# Altium project LedFlex.PrjPcb (part 3 of 4)
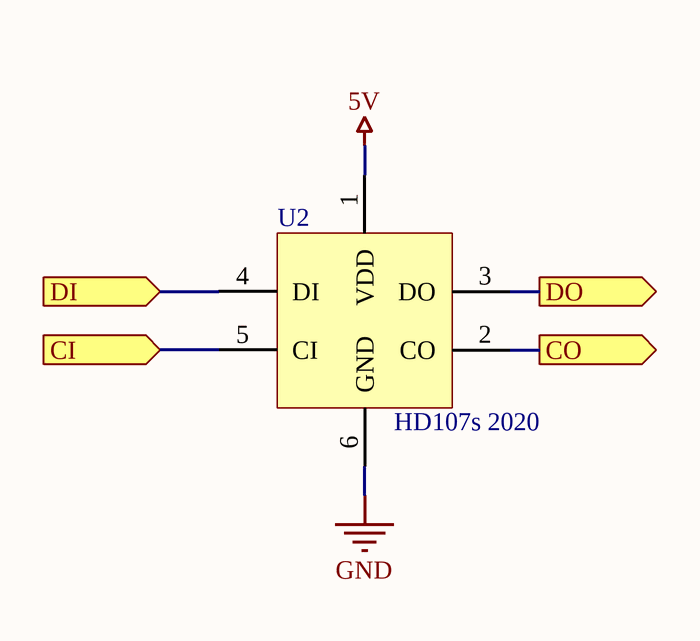
[diagram p3: LED_B.SchDoc]
## Nets that join several sheets
5V: LEDA1 (U1_1.1), LEDA2 (U1_2.1), LEDA3 (U1_3.1), LEDA4 (U1_4.1), LEDA5 (U1_5.1), LEDA6 (U1_6.1), LEDA7 (U1_7.1), LEDA8 (U1_8.1), LEDA9 (U1_9.1), LEDA10 (U1_10.1), LEDA11 (U1_11.1), LEDA12 (U1_12.1), LEDA13 (U1_13.1), LEDA14 (U1_14.1), LEDA15 (U1_15.1), LEDA16 (U1_16.1), LEDA17 (U1_17.1), LEDA18 (U1_18.1), LEDA19 (U1_19.1), LEDA20 (U1_20.1), LEDA21 (U1_21.1), LEDA22 (U1_22.1), LEDA23 (U1_23.1), LEDA24 (U1_24.1), LEDA25 (U1_25.1), LEDA26 (U1_26.1), LEDA27 (U1_27.1), LEDA28 (U1_28.1), LEDA29 (U1_29.1), LEDA30 (U1_30.1), LEDA31 (U1_31.1), LEDA32 (U1_32.1), LEDA33 (U1_33.1), LEDA34 (U1_34.1), LEDA35 (U1_35.1), LEDA36 (U1_36.1), LEDA37 (U1_37.1), LEDA38 (U1_38.1), LEDA39 (U1_39.1), LEDA40 (U1_40.1), LEDA41 (U1_41.1), LEDA42 (U1_42.1), LEDA43 (U1_43.1), LEDA44 (U1_44.1), LEDA45 (U1_45.1), LEDA46 (U1_46.1), LEDA47 (U1_47.1), LEDA48 (U1_48.1), LEDA49 (U1_49.1), LEDA50 (U1_50.1), LEDA51 (U1_51.1), LEDA52 (U1_52.1), LEDA53 (U1_53.1), LEDA54 (U1_54.1), LEDA55 (U1_55.1), LEDA56 (U1_56.1), LEDA57 (U1_57.1), LEDA58 (U1_58.1), LEDA59 (U1_59.1), LEDA60 (U1_60.1), LEDA61 (U1_61.1), LEDA62 (U1_62.1), LEDA63 (U1_63.1), LEDA64 (U1_64.1), LEDA65 (U1_65.1), LEDA66 (U1_66.1), LEDA67 (U1_67.1), LEDA68 (U1_68.1), LEDA69 (U1_69.1), LEDA70 (U1_70.1), LEDA71 (U1_71.1), LEDA72 (U1_72.1), LEDA73 (U1_73.1), LEDA74 (U1_74.1), LEDA75 (U1_75.1), LEDA76 (U1_76.1), LEDA77 (U1_77.1), LEDA78 (U1_78.1), LEDA79 (U1_79.1), LEDA80 (U1_80.1), LEDA81 (U1_81.1), LEDA82 (U1_82.1), LEDA83 (U1_83.1), LEDA84 (U1_84.1), LEDA85 (U1_85.1), LEDA86 (U1_86.1), LEDA87 (U1_87.1), LEDA88 (U1_88.1), LEDA89 (U1_89.1), LEDA90 (U1_90.1), LEDA91 (U1_91.1), LEDA92 (U1_92.1), LEDA93 (U1_93.1), LEDA94 (U1_94.1), LEDA95 (U1_95.1), LEDA96 (U1_96.1), LEDA97 (U1_97.1), LEDA98 (U1_98.1), LEDA99 (U1_99.1), LEDA100 (U1_100.1), LEDA101 (U1_101.1), LEDA102 (U1_102.1), LEDA103 (U1_103.1), LEDA104 (U1_104.1), LEDA105 (U1_105.1), LEDA106 (U1_106.1), LEDA107 (U1_107.1), LEDA108 (U1_108.1), LEDA109 (U1_109.1), LEDA110 (U1_110.1), LEDA111 (U1_111.1), LEDA112 (U1_112.1), LEDA113 (U1_113.1), LEDA114 (U1_114.1), LEDA115 (U1_115.1), LEDA116 (U1_116.1), LEDA117 (U1_117.1), LEDA118 (U1_118.1), LEDA119 (U1_119.1), LEDA120 (U1_120.1), LEDA121 (U1_121.1), LEDA122 (U1_122.1), LEDA123 (U1_123.1), LEDA124 (U1_124.1), LEDA125 (U1_125.1), LEDA126 (U1_126.1), LEDA127 (U1_127.1), LEDA128 (U1_128.1), LEDA129 (U1_129.1), LEDA130 (U1_130.1), LEDA131 (U1_131.1), LEDA132 (U1_132.1), LEDA133 (U1_133.1), LEDA134 (U1_134.1), LEDA135 (U1_135.1), LEDA136 (U1_136.1), LEDA137 (U1_137.1), LEDA138 (U1_138.1), LEDA139 (U1_139.1), LEDA140 (U1_140.1), LEDA141 (U1_141.1), LEDA142 (U1_142.1), LEDA143 (U1_143.1), LEDA144 (U1_144.1), LEDA145 (U1_145.1), LEDA146 (U1_146.1), LEDA147 (U1_147.1), LEDA148 (U1_148.1), LEDA149 (U1_149.1), LEDA150 (U1_150.1), LEDA151 (U1_151.1), LEDA152 (U1_152.1), LEDA153 (U1_153.1), LEDA154 (U1_154.1), LEDA155 (U1_155.1), LEDA156 (U1_156.1), LEDA157 (U1_157.1), LEDA158 (U1_158.1), LEDA159 (U1_159.1), LEDA160 (U1_160.1), LEDA161 (U1_161.1), LEDA162 (U1_162.1), LEDA163 (U1_163.1), LEDA164 (U1_164.1), LEDA165 (U1_165.1), LEDA166 (U1_166.1), LEDA167 (U1_167.1), LEDA168 (U1_168.1), LEDA169 (U1_169.1), LEDA170 (U1_170.1), LEDA171 (U1_171.1), LEDA172 (U1_172.1), LEDA173 (U1_173.1), LEDA174 (U1_174.1), LEDA175 (U1_175.1), LEDA176 (U1_176.1), LEDA177 (U1_177.1), LEDA178 (U1_178.1), LEDA179 (U1_179.1), LEDA180 (U1_180.1), LEDA181 (U1_181.1), LEDA182 (U1_182.1), LEDA183 (U1_183.1), LEDA184 (U1_184.1), LEDA185 (U1_185.1), LEDA186 (U1_186.1), LEDA187 (U1_187.1), LEDA188 (U1_188.1), LEDA189 (U1_189.1), LEDA190 (U1_190.1), LEDA191 (U1_191.1), LEDA192 (U1_192.1), LEDA193 (U1_193.1), LEDA194 (U1_194.1), LEDA195 (U1_195.1), LEDA196 (U1_196.1), LEDA197 (U1_197.1), LEDA198 (U1_198.1), LEDA199 (U1_199.1), LEDA200 (U1_200.1), LEDA201 (U1_201.1), LEDA202 (U1_202.1), LEDA203 (U1_203.1), LEDA204 (U1_204.1), LEDA205 (U1_205.1), LEDA206 (U1_206.1), LEDA207 (U1_207.1), LEDA208 (U1_208.1), LEDA209 (U1_209.1), LEDA210 (U1_210.1), LEDA211 (U1_211.1), LEDA212 (U1_212.1), LEDA213 (U1_213.1), LEDA214 (U1_214.1), LEDA215 (U1_215.1), LEDA216 (U1_216.1), LEDA217 (U1_217.1), LEDA218 (U1_218.1), LEDA219 (U1_219.1), LEDA220 (U1_220.1), LEDA221 (U1_221.1), LEDA222 (U1_222.1), LEDA223 (U1_223.1), LEDA224 (U1_224.1), LEDA225 (U1_225.1), LEDA226 (U1_226.1), LEDA227 (U1_227.1), LEDA228 (U1_228.1), LEDA229 (U1_229.1), LEDA230 (U1_230.1), LEDA231 (U1_231.1), LEDA232 (U1_232.1), LEDA233 (U1_233.1), LEDA234 (U1_234.1), LEDA235 (U1_235.1), LEDA236 (U1_236.1), LEDA237 (U1_237.1), LEDA238 (U1_238.1), LEDA239 (U1_239.1), LEDA240 (U1_240.1), LEDA241 (U1_241.1), LEDA242 (U1_242.1), LEDA243 (U1_243.1), LEDA244 (U1_244.1), LEDA245 (U1_245.1), LEDA246 (U1_246.1), LEDA247 (U1_247.1), LEDA248 (U1_248.1), LEDA249 (U1_249.1), LEDA250 (U1_250.1), LEDA251 (U1_251.1), LEDA252 (U1_252.1), LEDA253 (U1_253.1), LEDA254 (U1_254.1), LEDA255 (U1_255.1), LEDA256 (U1_256.1), LEDB1 (U2_1.1), LEDB2 (U2_2.1), LEDB3 (U2_3.1), LEDB4 (U2_4.1), LEDB5 (U2_5.1), LEDB6 (U2_6.1), LEDB7 (U2_7.1), LEDB8 (U2_8.1), LEDB9 (U2_9.1), LEDB10 (U2_10.1), LEDB11 (U2_11.1), LEDB12 (U2_12.1), LEDB13 (U2_13.1), LEDB14 (U2_14.1), LEDB15 (U2_15.1), LEDB16 (U2_16.1), LEDB17 (U2_17.1), LEDB18 (U2_18.1), LEDB19 (U2_19.1), LEDB20 (U2_20.1), LEDB21 (U2_21.1), LEDB22 (U2_22.1), LEDB23 (U2_23.1), LEDB24 (U2_24.1), LEDB25 (U2_25.1), LEDB26 (U2_26.1), LEDB27 (U2_27.1), LEDB28 (U2_28.1), LEDB29 (U2_29.1), LEDB30 (U2_30.1), LEDB31 (U2_31.1), LEDB32 (U2_32.1), LEDB33 (U2_33.1), LEDB34 (U2_34.1), LEDB35 (U2_35.1), LEDB36 (U2_36.1), LEDB37 (U2_37.1), LEDB38 (U2_38.1), LEDB39 (U2_39.1), LEDB40 (U2_40.1), LEDB41 (U2_41.1), LEDB42 (U2_42.1), LEDB43 (U2_43.1), LEDB44 (U2_44.1), LEDB45 (U2_45.1), LEDB46 (U2_46.1), LEDB47 (U2_47.1), LEDB48 (U2_48.1), LEDB49 (U2_49.1), LEDB50 (U2_50.1), LEDB51 (U2_51.1), LEDB52 (U2_52.1), LEDB53 (U2_53.1), LEDB54 (U2_54.1), LEDB55 (U2_55.1), LEDB56 (U2_56.1), LEDB57 (U2_57.1), LEDB58 (U2_58.1), LEDB59 (U2_59.1), LEDB60 (U2_60.1), LEDB61 (U2_61.1), LEDB62 (U2_62.1), LEDB63 (U2_63.1), LEDB64 (U2_64.1), LEDB65 (U2_65.1), LEDB66 (U2_66.1), LEDB67 (U2_67.1), LEDB68 (U2_68.1), LEDB69 (U2_69.1), LEDB70 (U2_70.1), LEDB71 (U2_71.1), LEDB72 (U2_72.1), LEDB73 (U2_73.1), LEDB74 (U2_74.1), LEDB75 (U2_75.1), LEDB76 (U2_76.1), LEDB77 (U2_77.1), LEDB78 (U2_78.1), LEDB79 (U2_79.1), LEDB80 (U2_80.1), LEDB81 (U2_81.1), LEDB82 (U2_82.1), LEDB83 (U2_83.1), LEDB84 (U2_84.1), LEDB85 (U2_85.1), LEDB86 (U2_86.1), LEDB87 (U2_87.1), LEDB88 (U2_88.1), LEDB89 (U2_89.1), LEDB90 (U2_90.1), LEDB91 (U2_91.1), LEDB92 (U2_92.1), LEDB93 (U2_93.1), LEDB94 (U2_94.1), LEDB95 (U2_95.1), LEDB96 (U2_96.1), LEDB97 (U2_97.1), LEDB98 (U2_98.1), LEDB99 (U2_99.1), LEDB100 (U2_100.1), LEDB101 (U2_101.1), LEDB102 (U2_102.1), LEDB103 (U2_103.1), LEDB104 (U2_104.1), LEDB105 (U2_105.1), LEDB106 (U2_106.1), LEDB107 (U2_107.1), LEDB108 (U2_108.1), LEDB109 (U2_109.1), LEDB110 (U2_110.1), LEDB111 (U2_111.1), LEDB112 (U2_112.1), LEDB113 (U2_113.1), LEDB114 (U2_114.1), LEDB115 (U2_115.1), LEDB116 (U2_116.1), LEDB117 (U2_117.1), LEDB118 (U2_118.1), LEDB119 (U2_119.1), LEDB120 (U2_120.1), LEDB121 (U2_121.1), LEDB122 (U2_122.1), LEDB123 (U2_123.1), LEDB124 (U2_124.1), LEDB125 (U2_125.1), LEDB126 (U2_126.1), LEDB127 (U2_127.1), LEDB128 (U2_128.1), LEDB129 (U2_129.1), LEDB130 (U2_130.1), LEDB131 (U2_131.1), LEDB132 (U2_132.1), LEDB133 (U2_133.1), LEDB134 (U2_134.1), LEDB135 (U2_135.1), LEDB136 (U2_136.1), LEDB137 (U2_137.1), LEDB138 (U2_138.1), LEDB139 (U2_139.1), LEDB140 (U2_140.1), LEDB141 (U2_141.1), LEDB142 (U2_142.1), LEDB143 (U2_143.1), LEDB144 (U2_144.1), LEDB145 (U2_145.1), LEDB146 (U2_146.1), LEDB147 (U2_147.1), LEDB148 (U2_148.1), LEDB149 (U2_149.1), LEDB150 (U2_150.1), LEDB151 (U2_151.1), LEDB152 (U2_152.1), LEDB153 (U2_153.1), LEDB154 (U2_154.1), LEDB155 (U2_155.1), LEDB156 (U2_156.1), LEDB157 (U2_157.1), LEDB158 (U2_158.1), LEDB159 (U2_159.1), LEDB160 (U2_160.1), LEDB161 (U2_161.1), LEDB162 (U2_162.1), LEDB163 (U2_163.1), LEDB164 (U2_164.1), LEDB165 (U2_165.1), LEDB166 (U2_166.1), LEDB167 (U2_167.1), LEDB168 (U2_168.1), LEDB169 (U2_169.1), LEDB170 (U2_170.1), LEDB171 (U2_171.1), LEDB172 (U2_172.1), LEDB173 (U2_173.1), LEDB174 (U2_174.1), LEDB175 (U2_175.1), LEDB176 (U2_176.1), LEDB177 (U2_177.1), LEDB178 (U2_178.1), LEDB179 (U2_179.1), LEDB180 (U2_180.1), LEDB181 (U2_181.1), LEDB182 (U2_182.1), LEDB183 (U2_183.1), LEDB184 (U2_184.1), LEDB185 (U2_185.1), LEDB186 (U2_186.1), LEDB187 (U2_187.1), LEDB188 (U2_188.1), LEDB189 (U2_189.1), LEDB190 (U2_190.1), LEDB191 (U2_191.1), LEDB192 (U2_192.1), LEDB193 (U2_193.1), LEDB194 (U2_194.1), LEDB195 (U2_195.1), LEDB196 (U2_196.1), LEDB197 (U2_197.1), LEDB198 (U2_198.1), LEDB199 (U2_199.1), LEDB200 (U2_200.1), LEDB201 (U2_201.1), LEDB202 (U2_202.1), LEDB203 (U2_203.1), LEDB204 (U2_204.1), LEDB205 (U2_205.1), LEDB206 (U2_206.1), LEDB207 (U2_207.1), LEDB208 (U2_208.1), LEDB209 (U2_209.1), LEDB210 (U2_210.1), LEDB211 (U2_211.1), LEDB212 (U2_212.1), LEDB213 (U2_213.1), LEDB214 (U2_214.1), LEDB215 (U2_215.1), LEDB216 (U2_216.1), LEDB217 (U2_217.1), LEDB218 (U2_218.1), LEDB219 (U2_219.1), LEDB220 (U2_220.1), LEDB221 (U2_221.1), LEDB222 (U2_222.1), LEDB223 (U2_223.1), LEDB224 (U2_224.1), LEDB225 (U2_225.1), LEDB226 (U2_226.1), LEDB227 (U2_227.1), LEDB228 (U2_228.1), LEDB229 (U2_229.1), LEDB230 (U2_230.1), LEDB231 (U2_231.1), LEDB232 (U2_232.1), LEDB233 (U2_233.1), LEDB234 (U2_234.1), LEDB235 (U2_235.1), LEDB236 (U2_236.1), LEDB237 (U2_237.1), LEDB238 (U2_238.1), LEDB239 (U2_239.1), LEDB240 (U2_240.1), LEDB241 (U2_241.1), LEDB242 (U2_242.1), LEDB243 (U2_243.1), LEDB244 (U2_244.1), LEDB245 (U2_245.1), LEDB246 (U2_246.1), LEDB247 (U2_247.1), LEDB248 (U2_248.1), LEDB249 (U2_249.1), LEDB250 (U2_250.1), LEDB251 (U2_251.1), LEDB252 (U2_252.1), LEDB253 (U2_253.1), LEDB254 (U2_254.1), LEDB255 (U2_255.1), LEDB256 (U2_256.1)
GND: LEDA1 (U1_1.6), LEDA2 (U1_2.6), LEDA3 (U1_3.6), LEDA4 (U1_4.6), LEDA5 (U1_5.6), LEDA6 (U1_6.6), LEDA7 (U1_7.6), LEDA8 (U1_8.6), LEDA9 (U1_9.6), LEDA10 (U1_10.6), LEDA11 (U1_11.6), LEDA12 (U1_12.6), LEDA13 (U1_13.6), LEDA14 (U1_14.6), LEDA15 (U1_15.6), LEDA16 (U1_16.6), LEDA17 (U1_17.6), LEDA18 (U1_18.6), LEDA19 (U1_19.6), LEDA20 (U1_20.6), LEDA21 (U1_21.6), LEDA22 (U1_22.6), LEDA23 (U1_23.6), LEDA24 (U1_24.6), LEDA25 (U1_25.6), LEDA26 (U1_26.6), LEDA27 (U1_27.6), LEDA28 (U1_28.6), LEDA29 (U1_29.6), LEDA30 (U1_30.6), LEDA31 (U1_31.6), LEDA32 (U1_32.6), LEDA33 (U1_33.6), LEDA34 (U1_34.6), LEDA35 (U1_35.6), LEDA36 (U1_36.6), LEDA37 (U1_37.6), LEDA38 (U1_38.6), LEDA39 (U1_39.6), LEDA40 (U1_40.6), LEDA41 (U1_41.6), LEDA42 (U1_42.6), LEDA43 (U1_43.6), LEDA44 (U1_44.6), LEDA45 (U1_45.6), LEDA46 (U1_46.6), LEDA47 (U1_47.6), LEDA48 (U1_48.6), LEDA49 (U1_49.6), LEDA50 (U1_50.6), LEDA51 (U1_51.6), LEDA52 (U1_52.6), LEDA53 (U1_53.6), LEDA54 (U1_54.6), LEDA55 (U1_55.6), LEDA56 (U1_56.6), LEDA57 (U1_57.6), LEDA58 (U1_58.6), LEDA59 (U1_59.6), LEDA60 (U1_60.6), LEDA61 (U1_61.6), LEDA62 (U1_62.6), LEDA63 (U1_63.6), LEDA64 (U1_64.6), LEDA65 (U1_65.6), LEDA66 (U1_66.6), LEDA67 (U1_67.6), LEDA68 (U1_68.6), LEDA69 (U1_69.6), LEDA70 (U1_70.6), LEDA71 (U1_71.6), LEDA72 (U1_72.6), LEDA73 (U1_73.6), LEDA74 (U1_74.6), LEDA75 (U1_75.6), LEDA76 (U1_76.6), LEDA77 (U1_77.6), LEDA78 (U1_78.6), LEDA79 (U1_79.6), LEDA80 (U1_80.6), LEDA81 (U1_81.6), LEDA82 (U1_82.6), LEDA83 (U1_83.6), LEDA84 (U1_84.6), LEDA85 (U1_85.6), LEDA86 (U1_86.6), LEDA87 (U1_87.6), LEDA88 (U1_88.6), LEDA89 (U1_89.6), LEDA90 (U1_90.6), LEDA91 (U1_91.6), LEDA92 (U1_92.6), LEDA93 (U1_93.6), LEDA94 (U1_94.6), LEDA95 (U1_95.6), LEDA96 (U1_96.6), LEDA97 (U1_97.6), LEDA98 (U1_98.6), LEDA99 (U1_99.6), LEDA100 (U1_100.6), LEDA101 (U1_101.6), LEDA102 (U1_102.6), LEDA103 (U1_103.6), LEDA104 (U1_104.6), LEDA105 (U1_105.6), LEDA106 (U1_106.6), LEDA107 (U1_107.6), LEDA108 (U1_108.6), LEDA109 (U1_109.6), LEDA110 (U1_110.6), LEDA111 (U1_111.6), LEDA112 (U1_112.6), LEDA113 (U1_113.6), LEDA114 (U1_114.6), LEDA115 (U1_115.6), LEDA116 (U1_116.6), LEDA117 (U1_117.6), LEDA118 (U1_118.6), LEDA119 (U1_119.6), LEDA120 (U1_120.6), LEDA121 (U1_121.6), LEDA122 (U1_122.6), LEDA123 (U1_123.6), LEDA124 (U1_124.6), LEDA125 (U1_125.6), LEDA126 (U1_126.6), LEDA127 (U1_127.6), LEDA128 (U1_128.6), LEDA129 (U1_129.6), LEDA130 (U1_130.6), LEDA131 (U1_131.6), LEDA132 (U1_132.6), LEDA133 (U1_133.6), LEDA134 (U1_134.6), LEDA135 (U1_135.6), LEDA136 (U1_136.6), LEDA137 (U1_137.6), LEDA138 (U1_138.6), LEDA139 (U1_139.6), LEDA140 (U1_140.6), LEDA141 (U1_141.6), LEDA142 (U1_142.6), LEDA143 (U1_143.6), LEDA144 (U1_144.6), LEDA145 (U1_145.6), LEDA146 (U1_146.6), LEDA147 (U1_147.6), LEDA148 (U1_148.6), LEDA149 (U1_149.6), LEDA150 (U1_150.6), LEDA151 (U1_151.6), LEDA152 (U1_152.6), LEDA153 (U1_153.6), LEDA154 (U1_154.6), LEDA155 (U1_155.6), LEDA156 (U1_156.6), LEDA157 (U1_157.6), LEDA158 (U1_158.6), LEDA159 (U1_159.6), LEDA160 (U1_160.6), LEDA161 (U1_161.6), LEDA162 (U1_162.6), LEDA163 (U1_163.6), LEDA164 (U1_164.6), LEDA165 (U1_165.6), LEDA166 (U1_166.6), LEDA167 (U1_167.6), LEDA168 (U1_168.6), LEDA169 (U1_169.6), LEDA170 (U1_170.6), LEDA171 (U1_171.6), LEDA172 (U1_172.6), LEDA173 (U1_173.6), LEDA174 (U1_174.6), LEDA175 (U1_175.6), LEDA176 (U1_176.6), LEDA177 (U1_177.6), LEDA178 (U1_178.6), LEDA179 (U1_179.6), LEDA180 (U1_180.6), LEDA181 (U1_181.6), LEDA182 (U1_182.6), LEDA183 (U1_183.6), LEDA184 (U1_184.6), LEDA185 (U1_185.6), LEDA186 (U1_186.6), LEDA187 (U1_187.6), LEDA188 (U1_188.6), LEDA189 (U1_189.6), LEDA190 (U1_190.6), LEDA191 (U1_191.6), LEDA192 (U1_192.6), LEDA193 (U1_193.6), LEDA194 (U1_194.6), LEDA195 (U1_195.6), LEDA196 (U1_196.6), LEDA197 (U1_197.6), LEDA198 (U1_198.6), LEDA199 (U1_199.6), LEDA200 (U1_200.6), LEDA201 (U1_201.6), LEDA202 (U1_202.6), LEDA203 (U1_203.6), LEDA204 (U1_204.6), LEDA205 (U1_205.6), LEDA206 (U1_206.6), LEDA207 (U1_207.6), LEDA208 (U1_208.6), LEDA209 (U1_209.6), LEDA210 (U1_210.6), LEDA211 (U1_211.6), LEDA212 (U1_212.6), LEDA213 (U1_213.6), LEDA214 (U1_214.6), LEDA215 (U1_215.6), LEDA216 (U1_216.6), LEDA217 (U1_217.6), LEDA218 (U1_218.6), LEDA219 (U1_219.6), LEDA220 (U1_220.6), LEDA221 (U1_221.6), LEDA222 (U1_222.6), LEDA223 (U1_223.6), LEDA224 (U1_224.6), LEDA225 (U1_225.6), LEDA226 (U1_226.6), LEDA227 (U1_227.6), LEDA228 (U1_228.6), LEDA229 (U1_229.6), LEDA230 (U1_230.6), LEDA231 (U1_231.6), LEDA232 (U1_232.6), LEDA233 (U1_233.6), LEDA234 (U1_234.6), LEDA235 (U1_235.6), LEDA236 (U1_236.6), LEDA237 (U1_237.6), LEDA238 (U1_238.6), LEDA239 (U1_239.6), LEDA240 (U1_240.6), LEDA241 (U1_241.6), LEDA242 (U1_242.6), LEDA243 (U1_243.6), LEDA244 (U1_244.6), LEDA245 (U1_245.6), LEDA246 (U1_246.6), LEDA247 (U1_247.6), LEDA248 (U1_248.6), LEDA249 (U1_249.6), LEDA250 (U1_250.6), LEDA251 (U1_251.6), LEDA252 (U1_252.6), LEDA253 (U1_253.6), LEDA254 (U1_254.6), LEDA255 (U1_255.6), LEDA256 (U1_256.6), LEDB1 (U2_1.6), LEDB2 (U2_2.6), LEDB3 (U2_3.6), LEDB4 (U2_4.6), LEDB5 (U2_5.6), LEDB6 (U2_6.6), LEDB7 (U2_7.6), LEDB8 (U2_8.6), LEDB9 (U2_9.6), LEDB10 (U2_10.6), LEDB11 (U2_11.6), LEDB12 (U2_12.6), LEDB13 (U2_13.6), LEDB14 (U2_14.6), LEDB15 (U2_15.6), LEDB16 (U2_16.6), LEDB17 (U2_17.6), LEDB18 (U2_18.6), LEDB19 (U2_19.6), LEDB20 (U2_20.6), LEDB21 (U2_21.6), LEDB22 (U2_22.6), LEDB23 (U2_23.6), LEDB24 (U2_24.6), LEDB25 (U2_25.6), LEDB26 (U2_26.6), LEDB27 (U2_27.6), LEDB28 (U2_28.6), LEDB29 (U2_29.6), LEDB30 (U2_30.6), LEDB31 (U2_31.6), LEDB32 (U2_32.6), LEDB33 (U2_33.6), LEDB34 (U2_34.6), LEDB35 (U2_35.6), LEDB36 (U2_36.6), LEDB37 (U2_37.6), LEDB38 (U2_38.6), LEDB39 (U2_39.6), LEDB40 (U2_40.6), LEDB41 (U2_41.6), LEDB42 (U2_42.6), LEDB43 (U2_43.6), LEDB44 (U2_44.6), LEDB45 (U2_45.6), LEDB46 (U2_46.6), LEDB47 (U2_47.6), LEDB48 (U2_48.6), LEDB49 (U2_49.6), LEDB50 (U2_50.6), LEDB51 (U2_51.6), LEDB52 (U2_52.6), LEDB53 (U2_53.6), LEDB54 (U2_54.6), LEDB55 (U2_55.6), LEDB56 (U2_56.6), LEDB57 (U2_57.6), LEDB58 (U2_58.6), LEDB59 (U2_59.6), LEDB60 (U2_60.6), LEDB61 (U2_61.6), LEDB62 (U2_62.6), LEDB63 (U2_63.6), LEDB64 (U2_64.6), LEDB65 (U2_65.6), LEDB66 (U2_66.6), LEDB67 (U2_67.6), LEDB68 (U2_68.6), LEDB69 (U2_69.6), LEDB70 (U2_70.6), LEDB71 (U2_71.6), LEDB72 (U2_72.6), LEDB73 (U2_73.6), LEDB74 (U2_74.6), LEDB75 (U2_75.6), LEDB76 (U2_76.6), LEDB77 (U2_77.6), LEDB78 (U2_78.6), LEDB79 (U2_79.6), LEDB80 (U2_80.6), LEDB81 (U2_81.6), LEDB82 (U2_82.6), LEDB83 (U2_83.6), LEDB84 (U2_84.6), LEDB85 (U2_85.6), LEDB86 (U2_86.6), LEDB87 (U2_87.6), LEDB88 (U2_88.6), LEDB89 (U2_89.6), LEDB90 (U2_90.6), LEDB91 (U2_91.6), LEDB92 (U2_92.6), LEDB93 (U2_93.6), LEDB94 (U2_94.6), LEDB95 (U2_95.6), LEDB96 (U2_96.6), LEDB97 (U2_97.6), LEDB98 (U2_98.6), LEDB99 (U2_99.6), LEDB100 (U2_100.6), LEDB101 (U2_101.6), LEDB102 (U2_102.6), LEDB103 (U2_103.6), LEDB104 (U2_104.6), LEDB105 (U2_105.6), LEDB106 (U2_106.6), LEDB107 (U2_107.6), LEDB108 (U2_108.6), LEDB109 (U2_109.6), LEDB110 (U2_110.6), LEDB111 (U2_111.6), LEDB112 (U2_112.6), LEDB113 (U2_113.6), LEDB114 (U2_114.6), LEDB115 (U2_115.6), LEDB116 (U2_116.6), LEDB117 (U2_117.6), LEDB118 (U2_118.6), LEDB119 (U2_119.6), LEDB120 (U2_120.6), LEDB121 (U2_121.6), LEDB122 (U2_122.6), LEDB123 (U2_123.6), LEDB124 (U2_124.6), LEDB125 (U2_125.6), LEDB126 (U2_126.6), LEDB127 (U2_127.6), LEDB128 (U2_128.6), LEDB129 (U2_129.6), LEDB130 (U2_130.6), LEDB131 (U2_131.6), LEDB132 (U2_132.6), LEDB133 (U2_133.6), LEDB134 (U2_134.6), LEDB135 (U2_135.6), LEDB136 (U2_136.6), LEDB137 (U2_137.6), LEDB138 (U2_138.6), LEDB139 (U2_139.6), LEDB140 (U2_140.6), LEDB141 (U2_141.6), LEDB142 (U2_142.6), LEDB143 (U2_143.6), LEDB144 (U2_144.6), LEDB145 (U2_145.6), LEDB146 (U2_146.6), LEDB147 (U2_147.6), LEDB148 (U2_148.6), LEDB149 (U2_149.6), LEDB150 (U2_150.6), LEDB151 (U2_151.6), LEDB152 (U2_152.6), LEDB153 (U2_153.6), LEDB154 (U2_154.6), LEDB155 (U2_155.6), LEDB156 (U2_156.6), LEDB157 (U2_157.6), LEDB158 (U2_158.6), LEDB159 (U2_159.6), LEDB160 (U2_160.6), LEDB161 (U2_161.6), LEDB162 (U2_162.6), LEDB163 (U2_163.6), LEDB164 (U2_164.6), LEDB165 (U2_165.6), LEDB166 (U2_166.6), LEDB167 (U2_167.6), LEDB168 (U2_168.6), LEDB169 (U2_169.6), LEDB170 (U2_170.6), LEDB171 (U2_171.6), LEDB172 (U2_172.6), LEDB173 (U2_173.6), LEDB174 (U2_174.6), LEDB175 (U2_175.6), LEDB176 (U2_176.6), LEDB177 (U2_177.6), LEDB178 (U2_178.6), LEDB179 (U2_179.6), LEDB180 (U2_180.6), LEDB181 (U2_181.6), LEDB182 (U2_182.6), LEDB183 (U2_183.6), LEDB184 (U2_184.6), LEDB185 (U2_185.6), LEDB186 (U2_186.6), LEDB187 (U2_187.6), LEDB188 (U2_188.6), LEDB189 (U2_189.6), LEDB190 (U2_190.6), LEDB191 (U2_191.6), LEDB192 (U2_192.6), LEDB193 (U2_193.6), LEDB194 (U2_194.6), LEDB195 (U2_195.6), LEDB196 (U2_196.6), LEDB197 (U2_197.6), LEDB198 (U2_198.6), LEDB199 (U2_199.6), LEDB200 (U2_200.6), LEDB201 (U2_201.6), LEDB202 (U2_202.6), LEDB203 (U2_203.6), LEDB204 (U2_204.6), LEDB205 (U2_205.6), LEDB206 (U2_206.6), LEDB207 (U2_207.6), LEDB208 (U2_208.6), LEDB209 (U2_209.6), LEDB210 (U2_210.6), LEDB211 (U2_211.6), LEDB212 (U2_212.6), LEDB213 (U2_213.6), LEDB214 (U2_214.6), LEDB215 (U2_215.6), LEDB216 (U2_216.6), LEDB217 (U2_217.6), LEDB218 (U2_218.6), LEDB219 (U2_219.6), LEDB220 (U2_220.6), LEDB221 (U2_221.6), LEDB222 (U2_222.6), LEDB223 (U2_223.6), LEDB224 (U2_224.6), LEDB225 (U2_225.6), LEDB226 (U2_226.6), LEDB227 (U2_227.6), LEDB228 (U2_228.6), LEDB229 (U2_229.6), LEDB230 (U2_230.6), LEDB231 (U2_231.6), LEDB232 (U2_232.6), LEDB233 (U2_233.6), LEDB234 (U2_234.6), LEDB235 (U2_235.6), LEDB236 (U2_236.6), LEDB237 (U2_237.6), LEDB238 (U2_238.6), LEDB239 (U2_239.6), LEDB240 (U2_240.6), LEDB241 (U2_241.6), LEDB242 (U2_242.6), LEDB243 (U2_243.6), LEDB244 (U2_244.6), LEDB245 (U2_245.6), LEDB246 (U2_246.6), LEDB247 (U2_247.6), LEDB248 (U2_248.6), LEDB249 (U2_249.6), LEDB250 (U2_250.6), LEDB251 (U2_251.6), LEDB252 (U2_252.6), LEDB253 (U2_253.6), LEDB254 (U2_254.6), LEDB255 (U2_255.6), LEDB256 (U2_256.6)
B_CI2: LEDB1 (U2_1.2), LEDB2 (U2_2.5)
B_CI3: LEDB2 (U2_2.2), LEDB3 (U2_3.5)
B_CI4: LEDB3 (U2_3.2), LEDB4 (U2_4.5)
B_CI5: LEDB4 (U2_4.2), LEDB5 (U2_5.5)
B_CI6: LEDB5 (U2_5.2), LEDB6 (U2_6.5)
B_CI7: LEDB6 (U2_6.2), LEDB7 (U2_7.5)
B_CI8: LEDB7 (U2_7.2), LEDB8 (U2_8.5)
B_CI9: LEDB8 (U2_8.2), LEDB9 (U2_9.5)
B_CI10: LEDB9 (U2_9.2), LEDB10 (U2_10.5)
B_CI11: LEDB10 (U2_10.2), LEDB11 (U2_11.5)
B_CI12: LEDB11 (U2_11.2), LEDB12 (U2_12.5)
B_CI13: LEDB12 (U2_12.2), LEDB13 (U2_13.5)
B_CI14: LEDB13 (U2_13.2), LEDB14 (U2_14.5)
B_CI15: LEDB14 (U2_14.2), LEDB15 (U2_15.5)
B_CI16: LEDB15 (U2_15.2), LEDB16 (U2_16.5)
B_CI17: LEDB16 (U2_16.2), LEDB17 (U2_17.5)
B_CI18: LEDB17 (U2_17.2), LEDB18 (U2_18.5)
B_CI19: LEDB18 (U2_18.2), LEDB19 (U2_19.5)
B_CI20: LEDB19 (U2_19.2), LEDB20 (U2_20.5)
B_CI21: LEDB20 (U2_20.2), LEDB21 (U2_21.5)
B_CI22: LEDB21 (U2_21.2), LEDB22 (U2_22.5)
B_CI23: LEDB22 (U2_22.2), LEDB23 (U2_23.5)
B_CI24: LEDB23 (U2_23.2), LEDB24 (U2_24.5)
B_CI25: LEDB24 (U2_24.2), LEDB25 (U2_25.5)
B_CI26: LEDB25 (U2_25.2), LEDB26 (U2_26.5)
B_CI27: LEDB26 (U2_26.2), LEDB27 (U2_27.5)
B_CI28: LEDB27 (U2_27.2), LEDB28 (U2_28.5)
B_CI29: LEDB28 (U2_28.2), LEDB29 (U2_29.5)
B_CI30: LEDB29 (U2_29.2), LEDB30 (U2_30.5)
B_CI31: LEDB30 (U2_30.2), LEDB31 (U2_31.5)
B_CI32: LEDB31 (U2_31.2), LEDB32 (U2_32.5)
B_CI33: LEDB32 (U2_32.2), LEDB33 (U2_33.5)
B_CI34: LEDB33 (U2_33.2), LEDB34 (U2_34.5)
B_CI35: LEDB34 (U2_34.2), LEDB35 (U2_35.5)
B_CI36: LEDB35 (U2_35.2), LEDB36 (U2_36.5)
B_CI37: LEDB36 (U2_36.2), LEDB37 (U2_37.5)
B_CI38: LEDB37 (U2_37.2), LEDB38 (U2_38.5)
B_CI39: LEDB38 (U2_38.2), LEDB39 (U2_39.5)
B_CI40: LEDB39 (U2_39.2), LEDB40 (U2_40.5)
B_CI41: LEDB40 (U2_40.2), LEDB41 (U2_41.5)
B_CI42: LEDB41 (U2_41.2), LEDB42 (U2_42.5)
B_CI43: LEDB42 (U2_42.2), LEDB43 (U2_43.5)
B_CI44: LEDB43 (U2_43.2), LEDB44 (U2_44.5)
B_CI45: LEDB44 (U2_44.2), LEDB45 (U2_45.5)
B_CI46: LEDB45 (U2_45.2), LEDB46 (U2_46.5)
B_CI47: LEDB46 (U2_46.2), LEDB47 (U2_47.5)
B_CI48: LEDB47 (U2_47.2), LEDB48 (U2_48.5)
B_CI49: LEDB48 (U2_48.2), LEDB49 (U2_49.5)
B_CI50: LEDB49 (U2_49.2), LEDB50 (U2_50.5)
B_CI51: LEDB50 (U2_50.2), LEDB51 (U2_51.5)
B_CI52: LEDB51 (U2_51.2), LEDB52 (U2_52.5)
B_CI53: LEDB52 (U2_52.2), LEDB53 (U2_53.5)
B_CI54: LEDB53 (U2_53.2), LEDB54 (U2_54.5)
B_CI55: LEDB54 (U2_54.2), LEDB55 (U2_55.5)
B_CI56: LEDB55 (U2_55.2), LEDB56 (U2_56.5)
B_CI57: LEDB56 (U2_56.2), LEDB57 (U2_57.5)
B_CI58: LEDB57 (U2_57.2), LEDB58 (U2_58.5)
B_CI59: LEDB58 (U2_58.2), LEDB59 (U2_59.5)
B_CI60: LEDB59 (U2_59.2), LEDB60 (U2_60.5)
B_CI61: LEDB60 (U2_60.2), LEDB61 (U2_61.5)
B_CI62: LEDB61 (U2_61.2), LEDB62 (U2_62.5)
B_CI63: LEDB62 (U2_62.2), LEDB63 (U2_63.5)
B_CI64: LEDB63 (U2_63.2), LEDB64 (U2_64.5)
B_CI65: LEDB64 (U2_64.2), LEDB65 (U2_65.5)
B_CI66: LEDB65 (U2_65.2), LEDB66 (U2_66.5)
B_CI67: LEDB66 (U2_66.2), LEDB67 (U2_67.5)
B_CI68: LEDB67 (U2_67.2), LEDB68 (U2_68.5)
B_CI69: LEDB68 (U2_68.2), LEDB69 (U2_69.5)
B_CI70: LEDB69 (U2_69.2), LEDB70 (U2_70.5)
B_CI71: LEDB70 (U2_70.2), LEDB71 (U2_71.5)
B_CI72: LEDB71 (U2_71.2), LEDB72 (U2_72.5)
B_CI73: LEDB72 (U2_72.2), LEDB73 (U2_73.5)
B_CI74: LEDB73 (U2_73.2), LEDB74 (U2_74.5)
B_CI75: LEDB74 (U2_74.2), LEDB75 (U2_75.5)
B_CI76: LEDB75 (U2_75.2), LEDB76 (U2_76.5)
B_CI77: LEDB76 (U2_76.2), LEDB77 (U2_77.5)
B_CI78: LEDB77 (U2_77.2), LEDB78 (U2_78.5)
B_CI79: LEDB78 (U2_78.2), LEDB79 (U2_79.5)
B_CI80: LEDB79 (U2_79.2), LEDB80 (U2_80.5)
B_CI81: LEDB80 (U2_80.2), LEDB81 (U2_81.5)
B_CI82: LEDB81 (U2_81.2), LEDB82 (U2_82.5)
B_CI83: LEDB82 (U2_82.2), LEDB83 (U2_83.5)
B_CI84: LEDB83 (U2_83.2), LEDB84 (U2_84.5)
B_CI85: LEDB84 (U2_84.2), LEDB85 (U2_85.5)
B_CI86: LEDB85 (U2_85.2), LEDB86 (U2_86.5)
B_CI87: LEDB86 (U2_86.2), LEDB87 (U2_87.5)
B_CI88: LEDB87 (U2_87.2), LEDB88 (U2_88.5)
B_CI89: LEDB88 (U2_88.2), LEDB89 (U2_89.5)
B_CI90: LEDB89 (U2_89.2), LEDB90 (U2_90.5)
B_CI91: LEDB90 (U2_90.2), LEDB91 (U2_91.5)
B_CI92: LEDB91 (U2_91.2), LEDB92 (U2_92.5)
B_CI93: LEDB92 (U2_92.2), LEDB93 (U2_93.5)
B_CI94: LEDB93 (U2_93.2), LEDB94 (U2_94.5)
B_CI95: LEDB94 (U2_94.2), LEDB95 (U2_95.5)
B_CI96: LEDB95 (U2_95.2), LEDB96 (U2_96.5)
B_CI97: LEDB96 (U2_96.2), LEDB97 (U2_97.5)
B_CI98: LEDB97 (U2_97.2), LEDB98 (U2_98.5)
B_CI99: LEDB98 (U2_98.2), LEDB99 (U2_99.5)
B_CI100: LEDB99 (U2_99.2), LEDB100 (U2_100.5)
B_CI101: LEDB100 (U2_100.2), LEDB101 (U2_101.5)
B_CI102: LEDB101 (U2_101.2), LEDB102 (U2_102.5)
B_CI103: LEDB102 (U2_102.2), LEDB103 (U2_103.5)
B_CI104: LEDB103 (U2_103.2), LEDB104 (U2_104.5)
B_CI105: LEDB104 (U2_104.2), LEDB105 (U2_105.5)
B_CI106: LEDB105 (U2_105.2), LEDB106 (U2_106.5)
B_CI107: LEDB106 (U2_106.2), LEDB107 (U2_107.5)
B_CI108: LEDB107 (U2_107.2), LEDB108 (U2_108.5)
B_CI109: LEDB108 (U2_108.2), LEDB109 (U2_109.5)
B_CI110: LEDB109 (U2_109.2), LEDB110 (U2_110.5)
B_CI111: LEDB110 (U2_110.2), LEDB111 (U2_111.5)
B_CI112: LEDB111 (U2_111.2), LEDB112 (U2_112.5)
B_CI113: LEDB112 (U2_112.2), LEDB113 (U2_113.5)
B_CI114: LEDB113 (U2_113.2), LEDB114 (U2_114.5)
B_CI115: LEDB114 (U2_114.2), LEDB115 (U2_115.5)
B_CI116: LEDB115 (U2_115.2), LEDB116 (U2_116.5)
B_CI117: LEDB116 (U2_116.2), LEDB117 (U2_117.5)
B_CI118: LEDB117 (U2_117.2), LEDB118 (U2_118.5)
B_CI119: LEDB118 (U2_118.2), LEDB119 (U2_119.5)
B_CI120: LEDB119 (U2_119.2), LEDB120 (U2_120.5)
B_CI121: LEDB120 (U2_120.2), LEDB121 (U2_121.5)
B_CI122: LEDB121 (U2_121.2), LEDB122 (U2_122.5)
B_CI123: LEDB122 (U2_122.2), LEDB123 (U2_123.5)
B_CI124: LEDB123 (U2_123.2), LEDB124 (U2_124.5)
B_CI125: LEDB124 (U2_124.2), LEDB125 (U2_125.5)
B_CI126: LEDB125 (U2_125.2), LEDB126 (U2_126.5)
B_CI127: LEDB126 (U2_126.2), LEDB127 (U2_127.5)
B_CI128: LEDB127 (U2_127.2), LEDB128 (U2_128.5)
B_CI129: LEDB128 (U2_128.2), LEDB129 (U2_129.5)
B_CI130: LEDB129 (U2_129.2), LEDB130 (U2_130.5)
B_CI131: LEDB130 (U2_130.2), LEDB131 (U2_131.5)
B_CI132: LEDB131 (U2_131.2), LEDB132 (U2_132.5)
B_CI133: LEDB132 (U2_132.2), LEDB133 (U2_133.5)
B_CI134: LEDB133 (U2_133.2), LEDB134 (U2_134.5)
B_CI135: LEDB134 (U2_134.2), LEDB135 (U2_135.5)
B_CI136: LEDB135 (U2_135.2), LEDB136 (U2_136.5)
B_CI137: LEDB136 (U2_136.2), LEDB137 (U2_137.5)
B_CI138: LEDB137 (U2_137.2), LEDB138 (U2_138.5)
B_CI139: LEDB138 (U2_138.2), LEDB139 (U2_139.5)
B_CI140: LEDB139 (U2_139.2), LEDB140 (U2_140.5)
B_CI141: LEDB140 (U2_140.2), LEDB141 (U2_141.5)
B_CI142: LEDB141 (U2_141.2), LEDB142 (U2_142.5)
B_CI143: LEDB142 (U2_142.2), LEDB143 (U2_143.5)
B_CI144: LEDB143 (U2_143.2), LEDB144 (U2_144.5)
B_CI145: LEDB144 (U2_144.2), LEDB145 (U2_145.5)
B_CI146: LEDB145 (U2_145.2), LEDB146 (U2_146.5)
B_CI147: LEDB146 (U2_146.2), LEDB147 (U2_147.5)
B_CI148: LEDB147 (U2_147.2), LEDB148 (U2_148.5)
B_CI149: LEDB148 (U2_148.2), LEDB149 (U2_149.5)
B_CI150: LEDB149 (U2_149.2), LEDB150 (U2_150.5)
B_CI151: LEDB150 (U2_150.2), LEDB151 (U2_151.5)
B_CI152: LEDB151 (U2_151.2), LEDB152 (U2_152.5)
B_CI153: LEDB152 (U2_152.2), LEDB153 (U2_153.5)
B_CI154: LEDB153 (U2_153.2), LEDB154 (U2_154.5)
B_CI155: LEDB154 (U2_154.2), LEDB155 (U2_155.5)
B_CI156: LEDB155 (U2_155.2), LEDB156 (U2_156.5)
B_CI157: LEDB156 (U2_156.2), LEDB157 (U2_157.5)
B_CI158: LEDB157 (U2_157.2), LEDB158 (U2_158.5)
B_CI159: LEDB158 (U2_158.2), LEDB159 (U2_159.5)
B_CI160: LEDB159 (U2_159.2), LEDB160 (U2_160.5)
B_CI161: LEDB160 (U2_160.2), LEDB161 (U2_161.5)
B_CI162: LEDB161 (U2_161.2), LEDB162 (U2_162.5)
B_CI163: LEDB162 (U2_162.2), LEDB163 (U2_163.5)
B_CI164: LEDB163 (U2_163.2), LEDB164 (U2_164.5)
B_CI165: LEDB164 (U2_164.2), LEDB165 (U2_165.5)
B_CI166: LEDB165 (U2_165.2), LEDB166 (U2_166.5)
B_CI167: LEDB166 (U2_166.2), LEDB167 (U2_167.5)
B_CI168: LEDB167 (U2_167.2), LEDB168 (U2_168.5)
B_CI169: LEDB168 (U2_168.2), LEDB169 (U2_169.5)
B_CI170: LEDB169 (U2_169.2), LEDB170 (U2_170.5)
B_CI171: LEDB170 (U2_170.2), LEDB171 (U2_171.5)
B_CI172: LEDB171 (U2_171.2), LEDB172 (U2_172.5)
B_CI173: LEDB172 (U2_172.2), LEDB173 (U2_173.5)
B_CI174: LEDB173 (U2_173.2), LEDB174 (U2_174.5)
B_CI175: LEDB174 (U2_174.2), LEDB175 (U2_175.5)
B_CI176: LEDB175 (U2_175.2), LEDB176 (U2_176.5)
B_CI177: LEDB176 (U2_176.2), LEDB177 (U2_177.5)
B_CI178: LEDB177 (U2_177.2), LEDB178 (U2_178.5)
B_CI179: LEDB178 (U2_178.2), LEDB179 (U2_179.5)
B_CI180: LEDB179 (U2_179.2), LEDB180 (U2_180.5)
B_CI181: LEDB180 (U2_180.2), LEDB181 (U2_181.5)
B_CI182: LEDB181 (U2_181.2), LEDB182 (U2_182.5)
B_CI183: LEDB182 (U2_182.2), LEDB183 (U2_183.5)
B_CI184: LEDB183 (U2_183.2), LEDB184 (U2_184.5)
B_CI185: LEDB184 (U2_184.2), LEDB185 (U2_185.5)
B_CI186: LEDB185 (U2_185.2), LEDB186 (U2_186.5)
B_CI187: LEDB186 (U2_186.2), LEDB187 (U2_187.5)
B_CI188: LEDB187 (U2_187.2), LEDB188 (U2_188.5)
B_CI189: LEDB188 (U2_188.2), LEDB189 (U2_189.5)
B_CI190: LEDB189 (U2_189.2), LEDB190 (U2_190.5)
B_CI191: LEDB190 (U2_190.2), LEDB191 (U2_191.5)
B_CI192: LEDB191 (U2_191.2), LEDB192 (U2_192.5)
B_CI193: LEDB192 (U2_192.2), LEDB193 (U2_193.5)
B_CI194: LEDB193 (U2_193.2), LEDB194 (U2_194.5)
B_CI195: LEDB194 (U2_194.2), LEDB195 (U2_195.5)
B_CI196: LEDB195 (U2_195.2), LEDB196 (U2_196.5)
B_CI197: LEDB196 (U2_196.2), LEDB197 (U2_197.5)
B_CI198: LEDB197 (U2_197.2), LEDB198 (U2_198.5)
B_CI199: LEDB198 (U2_198.2), LEDB199 (U2_199.5)
B_CI200: LEDB199 (U2_199.2), LEDB200 (U2_200.5)
B_CI201: LEDB200 (U2_200.2), LEDB201 (U2_201.5)
B_CI202: LEDB201 (U2_201.2), LEDB202 (U2_202.5)
B_CI203: LEDB202 (U2_202.2), LEDB203 (U2_203.5)
B_CI204: LEDB203 (U2_203.2), LEDB204 (U2_204.5)
B_CI205: LEDB204 (U2_204.2), LEDB205 (U2_205.5)
B_CI206: LEDB205 (U2_205.2), LEDB206 (U2_206.5)
B_CI207: LEDB206 (U2_206.2), LEDB207 (U2_207.5)
B_CI208: LEDB207 (U2_207.2), LEDB208 (U2_208.5)
B_CI209: LEDB208 (U2_208.2), LEDB209 (U2_209.5)
B_CI210: LEDB209 (U2_209.2), LEDB210 (U2_210.5)
B_CI211: LEDB210 (U2_210.2), LEDB211 (U2_211.5)
B_CI212: LEDB211 (U2_211.2), LEDB212 (U2_212.5)
B_CI213: LEDB212 (U2_212.2), LEDB213 (U2_213.5)
B_CI214: LEDB213 (U2_213.2), LEDB214 (U2_214.5)
B_CI215: LEDB214 (U2_214.2), LEDB215 (U2_215.5)
B_CI216: LEDB215 (U2_215.2), LEDB216 (U2_216.5)
B_CI217: LEDB216 (U2_216.2), LEDB217 (U2_217.5)
B_CI218: LEDB217 (U2_217.2), LEDB218 (U2_218.5)
B_CI219: LEDB218 (U2_218.2), LEDB219 (U2_219.5)
B_CI220: LEDB219 (U2_219.2), LEDB220 (U2_220.5)
B_CI221: LEDB220 (U2_220.2), LEDB221 (U2_221.5)
B_CI222: LEDB221 (U2_221.2), LEDB222 (U2_222.5)
B_CI223: LEDB222 (U2_222.2), LEDB223 (U2_223.5)
B_CI224: LEDB223 (U2_223.2), LEDB224 (U2_224.5)
B_CI225: LEDB224 (U2_224.2), LEDB225 (U2_225.5)
B_CI226: LEDB225 (U2_225.2), LEDB226 (U2_226.5)
B_CI227: LEDB226 (U2_226.2), LEDB227 (U2_227.5)
B_CI228: LEDB227 (U2_227.2), LEDB228 (U2_228.5)
B_CI229: LEDB228 (U2_228.2), LEDB229 (U2_229.5)
B_CI230: LEDB229 (U2_229.2), LEDB230 (U2_230.5)
B_CI231: LEDB230 (U2_230.2), LEDB231 (U2_231.5)
B_CI232: LEDB231 (U2_231.2), LEDB232 (U2_232.5)
B_CI233: LEDB232 (U2_232.2), LEDB233 (U2_233.5)
B_CI234: LEDB233 (U2_233.2), LEDB234 (U2_234.5)
B_CI235: LEDB234 (U2_234.2), LEDB235 (U2_235.5)
B_CI236: LEDB235 (U2_235.2), LEDB236 (U2_236.5)
B_CI237: LEDB236 (U2_236.2), LEDB237 (U2_237.5)
B_CI238: LEDB237 (U2_237.2), LEDB238 (U2_238.5)
B_CI239: LEDB238 (U2_238.2), LEDB239 (U2_239.5)
B_CI240: LEDB239 (U2_239.2), LEDB240 (U2_240.5)
B_CI241: LEDB240 (U2_240.2), LEDB241 (U2_241.5)
B_CI242: LEDB241 (U2_241.2), LEDB242 (U2_242.5)
B_CI243: LEDB242 (U2_242.2), LEDB243 (U2_243.5)
B_CI244: LEDB243 (U2_243.2), LEDB244 (U2_244.5)
B_CI245: LEDB244 (U2_244.2), LEDB245 (U2_245.5)
B_CI246: LEDB245 (U2_245.2), LEDB246 (U2_246.5)
B_CI247: LEDB246 (U2_246.2), LEDB247 (U2_247.5)
B_CI248: LEDB247 (U2_247.2), LEDB248 (U2_248.5)
B_CI249: LEDB248 (U2_248.2), LEDB249 (U2_249.5)
B_CI250: LEDB249 (U2_249.2), LEDB250 (U2_250.5)
B_CI251: LEDB250 (U2_250.2), LEDB251 (U2_251.5)
B_CI252: LEDB251 (U2_251.2), LEDB252 (U2_252.5)
B_CI253: LEDB252 (U2_252.2), LEDB253 (U2_253.5)
B_CI254: LEDB253 (U2_253.2), LEDB254 (U2_254.5)
B_CI255: LEDB254 (U2_254.2), LEDB255 (U2_255.5)
B_CI256: LEDB255 (U2_255.2), LEDB256 (U2_256.5)
B_DI2: LEDB1 (U2_1.3), LEDB2 (U2_2.4)
B_DI3: LEDB2 (U2_2.3), LEDB3 (U2_3.4)
B_DI4: LEDB3 (U2_3.3), LEDB4 (U2_4.4)
B_DI5: LEDB4 (U2_4.3), LEDB5 (U2_5.4)
B_DI6: LEDB5 (U2_5.3), LEDB6 (U2_6.4)
B_DI7: LEDB6 (U2_6.3), LEDB7 (U2_7.4)
B_DI8: LEDB7 (U2_7.3), LEDB8 (U2_8.4)
B_DI9: LEDB8 (U2_8.3), LEDB9 (U2_9.4)
B_DI10: LEDB9 (U2_9.3), LEDB10 (U2_10.4)
B_DI11: LEDB10 (U2_10.3), LEDB11 (U2_11.4)
B_DI12: LEDB11 (U2_11.3), LEDB12 (U2_12.4)
B_DI13: LEDB12 (U2_12.3), LEDB13 (U2_13.4)
B_DI14: LEDB13 (U2_13.3), LEDB14 (U2_14.4)
B_DI15: LEDB14 (U2_14.3), LEDB15 (U2_15.4)
B_DI16: LEDB15 (U2_15.3), LEDB16 (U2_16.4)
B_DI17: LEDB16 (U2_16.3), LEDB17 (U2_17.4)
B_DI18: LEDB17 (U2_17.3), LEDB18 (U2_18.4)
B_DI19: LEDB18 (U2_18.3), LEDB19 (U2_19.4)
B_DI20: LEDB19 (U2_19.3), LEDB20 (U2_20.4)
B_DI21: LEDB20 (U2_20.3), LEDB21 (U2_21.4)
B_DI22: LEDB21 (U2_21.3), LEDB22 (U2_22.4)
B_DI23: LEDB22 (U2_22.3), LEDB23 (U2_23.4)
B_DI24: LEDB23 (U2_23.3), LEDB24 (U2_24.4)
B_DI25: LEDB24 (U2_24.3), LEDB25 (U2_25.4)
B_DI26: LEDB25 (U2_25.3), LEDB26 (U2_26.4)
B_DI27: LEDB26 (U2_26.3), LEDB27 (U2_27.4)
B_DI28: LEDB27 (U2_27.3), LEDB28 (U2_28.4)
B_DI29: LEDB28 (U2_28.3), LEDB29 (U2_29.4)
B_DI30: LEDB29 (U2_29.3), LEDB30 (U2_30.4)
B_DI31: LEDB30 (U2_30.3), LEDB31 (U2_31.4)
B_DI32: LEDB31 (U2_31.3), LEDB32 (U2_32.4)
B_DI33: LEDB32 (U2_32.3), LEDB33 (U2_33.4)
B_DI34: LEDB33 (U2_33.3), LEDB34 (U2_34.4)
B_DI35: LEDB34 (U2_34.3), LEDB35 (U2_35.4)
B_DI36: LEDB35 (U2_35.3), LEDB36 (U2_36.4)
B_DI37: LEDB36 (U2_36.3), LEDB37 (U2_37.4)
B_DI38: LEDB37 (U2_37.3), LEDB38 (U2_38.4)
B_DI39: LEDB38 (U2_38.3), LEDB39 (U2_39.4)
B_DI40: LEDB39 (U2_39.3), LEDB40 (U2_40.4)
B_DI41: LEDB40 (U2_40.3), LEDB41 (U2_41.4)
B_DI42: LEDB41 (U2_41.3), LEDB42 (U2_42.4)
B_DI43: LEDB42 (U2_42.3), LEDB43 (U2_43.4)
B_DI44: LEDB43 (U2_43.3), LEDB44 (U2_44.4)
B_DI45: LEDB44 (U2_44.3), LEDB45 (U2_45.4)
B_DI46: LEDB45 (U2_45.3), LEDB46 (U2_46.4)
B_DI47: LEDB46 (U2_46.3), LEDB47 (U2_47.4)
B_DI48: LEDB47 (U2_47.3), LEDB48 (U2_48.4)
B_DI49: LEDB48 (U2_48.3), LEDB49 (U2_49.4)
B_DI50: LEDB49 (U2_49.3), LEDB50 (U2_50.4)
B_DI51: LEDB50 (U2_50.3), LEDB51 (U2_51.4)
B_DI52: LEDB51 (U2_51.3), LEDB52 (U2_52.4)
B_DI53: LEDB52 (U2_52.3), LEDB53 (U2_53.4)
B_DI54: LEDB53 (U2_53.3), LEDB54 (U2_54.4)
B_DI55: LEDB54 (U2_54.3), LEDB55 (U2_55.4)
B_DI56: LEDB55 (U2_55.3), LEDB56 (U2_56.4)
B_DI57: LEDB56 (U2_56.3), LEDB57 (U2_57.4)
B_DI58: LEDB57 (U2_57.3), LEDB58 (U2_58.4)
B_DI59: LEDB58 (U2_58.3), LEDB59 (U2_59.4)
B_DI60: LEDB59 (U2_59.3), LEDB60 (U2_60.4)
B_DI61: LEDB60 (U2_60.3), LEDB61 (U2_61.4)
B_DI62: LEDB61 (U2_61.3), LEDB62 (U2_62.4)
B_DI63: LEDB62 (U2_62.3), LEDB63 (U2_63.4)
B_DI64: LEDB63 (U2_63.3), LEDB64 (U2_64.4)
B_DI65: LEDB64 (U2_64.3), LEDB65 (U2_65.4)
B_DI66: LEDB65 (U2_65.3), LEDB66 (U2_66.4)
B_DI67: LEDB66 (U2_66.3), LEDB67 (U2_67.4)
B_DI68: LEDB67 (U2_67.3), LEDB68 (U2_68.4)
B_DI69: LEDB68 (U2_68.3), LEDB69 (U2_69.4)
B_DI70: LEDB69 (U2_69.3), LEDB70 (U2_70.4)
B_DI71: LEDB70 (U2_70.3), LEDB71 (U2_71.4)
B_DI72: LEDB71 (U2_71.3), LEDB72 (U2_72.4)
B_DI73: LEDB72 (U2_72.3), LEDB73 (U2_73.4)
B_DI74: LEDB73 (U2_73.3), LEDB74 (U2_74.4)
B_DI75: LEDB74 (U2_74.3), LEDB75 (U2_75.4)
B_DI76: LEDB75 (U2_75.3), LEDB76 (U2_76.4)
B_DI77: LEDB76 (U2_76.3), LEDB77 (U2_77.4)
B_DI78: LEDB77 (U2_77.3), LEDB78 (U2_78.4)
B_DI79: LEDB78 (U2_78.3), LEDB79 (U2_79.4)
B_DI80: LEDB79 (U2_79.3), LEDB80 (U2_80.4)
B_DI81: LEDB80 (U2_80.3), LEDB81 (U2_81.4)
B_DI82: LEDB81 (U2_81.3), LEDB82 (U2_82.4)
B_DI83: LEDB82 (U2_82.3), LEDB83 (U2_83.4)
B_DI84: LEDB83 (U2_83.3), LEDB84 (U2_84.4)
B_DI85: LEDB84 (U2_84.3), LEDB85 (U2_85.4)
B_DI86: LEDB85 (U2_85.3), LEDB86 (U2_86.4)
B_DI87: LEDB86 (U2_86.3), LEDB87 (U2_87.4)
B_DI88: LEDB87 (U2_87.3), LEDB88 (U2_88.4)
B_DI89: LEDB88 (U2_88.3), LEDB89 (U2_89.4)
B_DI90: LEDB89 (U2_89.3), LEDB90 (U2_90.4)
B_DI91: LEDB90 (U2_90.3), LEDB91 (U2_91.4)
B_DI92: LEDB91 (U2_91.3), LEDB92 (U2_92.4)
B_DI93: LEDB92 (U2_92.3), LEDB93 (U2_93.4)
B_DI94: LEDB93 (U2_93.3), LEDB94 (U2_94.4)
B_DI95: LEDB94 (U2_94.3), LEDB95 (U2_95.4)
B_DI96: LEDB95 (U2_95.3), LEDB96 (U2_96.4)
B_DI97: LEDB96 (U2_96.3), LEDB97 (U2_97.4)
B_DI98: LEDB97 (U2_97.3), LEDB98 (U2_98.4)
B_DI99: LEDB98 (U2_98.3), LEDB99 (U2_99.4)
B_DI100: LEDB99 (U2_99.3), LEDB100 (U2_100.4)
B_DI101: LEDB100 (U2_100.3), LEDB101 (U2_101.4)
B_DI102: LEDB101 (U2_101.3), LEDB102 (U2_102.4)
B_DI103: LEDB102 (U2_102.3), LEDB103 (U2_103.4)
B_DI104: LEDB103 (U2_103.3), LEDB104 (U2_104.4)
B_DI105: LEDB104 (U2_104.3), LEDB105 (U2_105.4)
B_DI106: LEDB105 (U2_105.3), LEDB106 (U2_106.4)
B_DI107: LEDB106 (U2_106.3), LEDB107 (U2_107.4)
B_DI108: LEDB107 (U2_107.3), LEDB108 (U2_108.4)
B_DI109: LEDB108 (U2_108.3), LEDB109 (U2_109.4)
B_DI110: LEDB109 (U2_109.3), LEDB110 (U2_110.4)
B_DI111: LEDB110 (U2_110.3), LEDB111 (U2_111.4)
B_DI112: LEDB111 (U2_111.3), LEDB112 (U2_112.4)
B_DI113: LEDB112 (U2_112.3), LEDB113 (U2_113.4)
B_DI114: LEDB113 (U2_113.3), LEDB114 (U2_114.4)
B_DI115: LEDB114 (U2_114.3), LEDB115 (U2_115.4)
B_DI116: LEDB115 (U2_115.3), LEDB116 (U2_116.4)
B_DI117: LEDB116 (U2_116.3), LEDB117 (U2_117.4)
B_DI118: LEDB117 (U2_117.3), LEDB118 (U2_118.4)
B_DI119: LEDB118 (U2_118.3), LEDB119 (U2_119.4)
B_DI120: LEDB119 (U2_119.3), LEDB120 (U2_120.4)
B_DI121: LEDB120 (U2_120.3), LEDB121 (U2_121.4)
B_DI122: LEDB121 (U2_121.3), LEDB122 (U2_122.4)
B_DI123: LEDB122 (U2_122.3), LEDB123 (U2_123.4)
B_DI124: LEDB123 (U2_123.3), LEDB124 (U2_124.4)
B_DI125: LEDB124 (U2_124.3), LEDB125 (U2_125.4)
B_DI126: LEDB125 (U2_125.3), LEDB126 (U2_126.4)
B_DI127: LEDB126 (U2_126.3), LEDB127 (U2_127.4)
B_DI128: LEDB127 (U2_127.3), LEDB128 (U2_128.4)
B_DI129: LEDB128 (U2_128.3), LEDB129 (U2_129.4)
B_DI130: LEDB129 (U2_129.3), LEDB130 (U2_130.4)
B_DI131: LEDB130 (U2_130.3), LEDB131 (U2_131.4)
B_DI132: LEDB131 (U2_131.3), LEDB132 (U2_132.4)
B_DI133: LEDB132 (U2_132.3), LEDB133 (U2_133.4)
B_DI134: LEDB133 (U2_133.3), LEDB134 (U2_134.4)
B_DI135: LEDB134 (U2_134.3), LEDB135 (U2_135.4)
B_DI136: LEDB135 (U2_135.3), LEDB136 (U2_136.4)
B_DI137: LEDB136 (U2_136.3), LEDB137 (U2_137.4)
B_DI138: LEDB137 (U2_137.3), LEDB138 (U2_138.4)
B_DI139: LEDB138 (U2_138.3), LEDB139 (U2_139.4)
B_DI140: LEDB139 (U2_139.3), LEDB140 (U2_140.4)
B_DI141: LEDB140 (U2_140.3), LEDB141 (U2_141.4)
B_DI142: LEDB141 (U2_141.3), LEDB142 (U2_142.4)
B_DI143: LEDB142 (U2_142.3), LEDB143 (U2_143.4)
B_DI144: LEDB143 (U2_143.3), LEDB144 (U2_144.4)
B_DI145: LEDB144 (U2_144.3), LEDB145 (U2_145.4)
B_DI146: LEDB145 (U2_145.3), LEDB146 (U2_146.4)
B_DI147: LEDB146 (U2_146.3), LEDB147 (U2_147.4)
B_DI148: LEDB147 (U2_147.3), LEDB148 (U2_148.4)
B_DI149: LEDB148 (U2_148.3), LEDB149 (U2_149.4)
B_DI150: LEDB149 (U2_149.3), LEDB150 (U2_150.4)
B_DI151: LEDB150 (U2_150.3), LEDB151 (U2_151.4)
B_DI152: LEDB151 (U2_151.3), LEDB152 (U2_152.4)
B_DI153: LEDB152 (U2_152.3), LEDB153 (U2_153.4)
B_DI154: LEDB153 (U2_153.3), LEDB154 (U2_154.4)
B_DI155: LEDB154 (U2_154.3), LEDB155 (U2_155.4)
B_DI156: LEDB155 (U2_155.3), LEDB156 (U2_156.4)
B_DI157: LEDB156 (U2_156.3), LEDB157 (U2_157.4)
B_DI158: LEDB157 (U2_157.3), LEDB158 (U2_158.4)
B_DI159: LEDB158 (U2_158.3), LEDB159 (U2_159.4)
B_DI160: LEDB159 (U2_159.3), LEDB160 (U2_160.4)
B_DI161: LEDB160 (U2_160.3), LEDB161 (U2_161.4)
B_DI162: LEDB161 (U2_161.3), LEDB162 (U2_162.4)
B_DI163: LEDB162 (U2_162.3), LEDB163 (U2_163.4)
B_DI164: LEDB163 (U2_163.3), LEDB164 (U2_164.4)
B_DI165: LEDB164 (U2_164.3), LEDB165 (U2_165.4)
B_DI166: LEDB165 (U2_165.3), LEDB166 (U2_166.4)
B_DI167: LEDB166 (U2_166.3), LEDB167 (U2_167.4)
B_DI168: LEDB167 (U2_167.3), LEDB168 (U2_168.4)
B_DI169: LEDB168 (U2_168.3), LEDB169 (U2_169.4)
B_DI170: LEDB169 (U2_169.3), LEDB170 (U2_170.4)
B_DI171: LEDB170 (U2_170.3), LEDB171 (U2_171.4)
B_DI172: LEDB171 (U2_171.3), LEDB172 (U2_172.4)
B_DI173: LEDB172 (U2_172.3), LEDB173 (U2_173.4)
B_DI174: LEDB173 (U2_173.3), LEDB174 (U2_174.4)
B_DI175: LEDB174 (U2_174.3), LEDB175 (U2_175.4)
B_DI176: LEDB175 (U2_175.3), LEDB176 (U2_176.4)
B_DI177: LEDB176 (U2_176.3), LEDB177 (U2_177.4)
B_DI178: LEDB177 (U2_177.3), LEDB178 (U2_178.4)
B_DI179: LEDB178 (U2_178.3), LEDB179 (U2_179.4)
B_DI180: LEDB179 (U2_179.3), LEDB180 (U2_180.4)
B_DI181: LEDB180 (U2_180.3), LEDB181 (U2_181.4)
B_DI182: LEDB181 (U2_181.3), LEDB182 (U2_182.4)
B_DI183: LEDB182 (U2_182.3), LEDB183 (U2_183.4)
B_DI184: LEDB183 (U2_183.3), LEDB184 (U2_184.4)
B_DI185: LEDB184 (U2_184.3), LEDB185 (U2_185.4)
B_DI186: LEDB185 (U2_185.3), LEDB186 (U2_186.4)
B_DI187: LEDB186 (U2_186.3), LEDB187 (U2_187.4)
B_DI188: LEDB187 (U2_187.3), LEDB188 (U2_188.4)
B_DI189: LEDB188 (U2_188.3), LEDB189 (U2_189.4)
B_DI190: LEDB189 (U2_189.3), LEDB190 (U2_190.4)
B_DI191: LEDB190 (U2_190.3), LEDB191 (U2_191.4)
B_DI192: LEDB191 (U2_191.3), LEDB192 (U2_192.4)
B_DI193: LEDB192 (U2_192.3), LEDB193 (U2_193.4)
B_DI194: LEDB193 (U2_193.3), LEDB194 (U2_194.4)
B_DI195: LEDB194 (U2_194.3), LEDB195 (U2_195.4)
B_DI196: LEDB195 (U2_195.3), LEDB196 (U2_196.4)
B_DI197: LEDB196 (U2_196.3), LEDB197 (U2_197.4)
B_DI198: LEDB197 (U2_197.3), LEDB198 (U2_198.4)
B_DI199: LEDB198 (U2_198.3), LEDB199 (U2_199.4)
B_DI200: LEDB199 (U2_199.3), LEDB200 (U2_200.4)
B_DI201: LEDB200 (U2_200.3), LEDB201 (U2_201.4)
B_DI202: LEDB201 (U2_201.3), LEDB202 (U2_202.4)
B_DI203: LEDB202 (U2_202.3), LEDB203 (U2_203.4)
B_DI204: LEDB203 (U2_203.3), LEDB204 (U2_204.4)
B_DI205: LEDB204 (U2_204.3), LEDB205 (U2_205.4)
B_DI206: LEDB205 (U2_205.3), LEDB206 (U2_206.4)
B_DI207: LEDB206 (U2_206.3), LEDB207 (U2_207.4)
B_DI208: LEDB207 (U2_207.3), LEDB208 (U2_208.4)
B_DI209: LEDB208 (U2_208.3), LEDB209 (U2_209.4)
B_DI210: LEDB209 (U2_209.3), LEDB210 (U2_210.4)
B_DI211: LEDB210 (U2_210.3), LEDB211 (U2_211.4)
B_DI212: LEDB211 (U2_211.3), LEDB212 (U2_212.4)
B_DI213: LEDB212 (U2_212.3), LEDB213 (U2_213.4)
B_DI214: LEDB213 (U2_213.3), LEDB214 (U2_214.4)
B_DI215: LEDB214 (U2_214.3), LEDB215 (U2_215.4)
B_DI216: LEDB215 (U2_215.3), LEDB216 (U2_216.4)
B_DI217: LEDB216 (U2_216.3), LEDB217 (U2_217.4)
B_DI218: LEDB217 (U2_217.3), LEDB218 (U2_218.4)
B_DI219: LEDB218 (U2_218.3), LEDB219 (U2_219.4)
B_DI220: LEDB219 (U2_219.3), LEDB220 (U2_220.4)
B_DI221: LEDB220 (U2_220.3), LEDB221 (U2_221.4)
B_DI222: LEDB221 (U2_221.3), LEDB222 (U2_222.4)
B_DI223: LEDB222 (U2_222.3), LEDB223 (U2_223.4)
B_DI224: LEDB223 (U2_223.3), LEDB224 (U2_224.4)
B_DI225: LEDB224 (U2_224.3), LEDB225 (U2_225.4)
B_DI226: LEDB225 (U2_225.3), LEDB226 (U2_226.4)
B_DI227: LEDB226 (U2_226.3), LEDB227 (U2_227.4)
B_DI228: LEDB227 (U2_227.3), LEDB228 (U2_228.4)
B_DI229: LEDB228 (U2_228.3), LEDB229 (U2_229.4)
B_DI230: LEDB229 (U2_229.3), LEDB230 (U2_230.4)
B_DI231: LEDB230 (U2_230.3), LEDB231 (U2_231.4)
B_DI232: LEDB231 (U2_231.3), LEDB232 (U2_232.4)
B_DI233: LEDB232 (U2_232.3), LEDB233 (U2_233.4)
B_DI234: LEDB233 (U2_233.3), LEDB234 (U2_234.4)
B_DI235: LEDB234 (U2_234.3), LEDB235 (U2_235.4)
B_DI236: LEDB235 (U2_235.3), LEDB236 (U2_236.4)
B_DI237: LEDB236 (U2_236.3), LEDB237 (U2_237.4)
B_DI238: LEDB237 (U2_237.3), LEDB238 (U2_238.4)
B_DI239: LEDB238 (U2_238.3), LEDB239 (U2_239.4)
B_DI240: LEDB239 (U2_239.3), LEDB240 (U2_240.4)
B_DI241: LEDB240 (U2_240.3), LEDB241 (U2_241.4)
B_DI242: LEDB241 (U2_241.3), LEDB242 (U2_242.4)
B_DI243: LEDB242 (U2_242.3), LEDB243 (U2_243.4)
B_DI244: LEDB243 (U2_243.3), LEDB244 (U2_244.4)
B_DI245: LEDB244 (U2_244.3), LEDB245 (U2_245.4)
B_DI246: LEDB245 (U2_245.3), LEDB246 (U2_246.4)
B_DI247: LEDB246 (U2_246.3), LEDB247 (U2_247.4)
B_DI248: LEDB247 (U2_247.3), LEDB248 (U2_248.4)
B_DI249: LEDB248 (U2_248.3), LEDB249 (U2_249.4)
B_DI250: LEDB249 (U2_249.3), LEDB250 (U2_250.4)
B_DI251: LEDB250 (U2_250.3), LEDB251 (U2_251.4)
B_DI252: LEDB251 (U2_251.3), LEDB252 (U2_252.4)
B_DI253: LEDB252 (U2_252.3), LEDB253 (U2_253.4)
B_DI254: LEDB253 (U2_253.3), LEDB254 (U2_254.4)
B_DI255: LEDB254 (U2_254.3), LEDB255 (U2_255.4)
B_DI256: LEDB255 (U2_255.3), LEDB256 (U2_256.4)
CI2: LEDA1 (U1_1.2), LEDA2 (U1_2.5)
CI3: LEDA2 (U1_2.2), LEDA3 (U1_3.5)
CI4: LEDA3 (U1_3.2), LEDA4 (U1_4.5)
CI5: LEDA4 (U1_4.2), LEDA5 (U1_5.5)
CI6: LEDA5 (U1_5.2), LEDA6 (U1_6.5)
CI7: LEDA6 (U1_6.2), LEDA7 (U1_7.5)
CI8: LEDA7 (U1_7.2), LEDA8 (U1_8.5)
CI9: LEDA8 (U1_8.2), LEDA9 (U1_9.5)
CI10: LEDA9 (U1_9.2), LEDA10 (U1_10.5)
CI11: LEDA10 (U1_10.2), LEDA11 (U1_11.5)
CI12: LEDA11 (U1_11.2), LEDA12 (U1_12.5)
CI13: LEDA12 (U1_12.2), LEDA13 (U1_13.5)
CI14: LEDA13 (U1_13.2), LEDA14 (U1_14.5)
CI15: LEDA14 (U1_14.2), LEDA15 (U1_15.5)
CI16: LEDA15 (U1_15.2), LEDA16 (U1_16.5)
CI17: LEDA16 (U1_16.2), LEDA17 (U1_17.5)
CI18: LEDA17 (U1_17.2), LEDA18 (U1_18.5)
CI19: LEDA18 (U1_18.2), LEDA19 (U1_19.5)
CI20: LEDA19 (U1_19.2), LEDA20 (U1_20.5)
CI21: LEDA20 (U1_20.2), LEDA21 (U1_21.5)
CI22: LEDA21 (U1_21.2), LEDA22 (U1_22.5)
CI23: LEDA22 (U1_22.2), LEDA23 (U1_23.5)
CI24: LEDA23 (U1_23.2), LEDA24 (U1_24.5)
CI25: LEDA24 (U1_24.2), LEDA25 (U1_25.5)
CI26: LEDA25 (U1_25.2), LEDA26 (U1_26.5)
CI27: LEDA26 (U1_26.2), LEDA27 (U1_27.5)
CI28: LEDA27 (U1_27.2), LEDA28 (U1_28.5)
CI29: LEDA28 (U1_28.2), LEDA29 (U1_29.5)
CI30: LEDA29 (U1_29.2), LEDA30 (U1_30.5)
CI31: LEDA30 (U1_30.2), LEDA31 (U1_31.5)
CI32: LEDA31 (U1_31.2), LEDA32 (U1_32.5)
CI33: LEDA32 (U1_32.2), LEDA33 (U1_33.5)
CI34: LEDA33 (U1_33.2), LEDA34 (U1_34.5)
CI35: LEDA34 (U1_34.2), LEDA35 (U1_35.5)
CI36: LEDA35 (U1_35.2), LEDA36 (U1_36.5)
CI37: LEDA36 (U1_36.2), LEDA37 (U1_37.5)
CI38: LEDA37 (U1_37.2), LEDA38 (U1_38.5)
CI39: LEDA38 (U1_38.2), LEDA39 (U1_39.5)
CI40: LEDA39 (U1_39.2), LEDA40 (U1_40.5)
CI41: LEDA40 (U1_40.2), LEDA41 (U1_41.5)
CI42: LEDA41 (U1_41.2), LEDA42 (U1_42.5)
CI43: LEDA42 (U1_42.2), LEDA43 (U1_43.5)
CI44: LEDA43 (U1_43.2), LEDA44 (U1_44.5)
CI45: LEDA44 (U1_44.2), LEDA45 (U1_45.5)
CI46: LEDA45 (U1_45.2), LEDA46 (U1_46.5)
CI47: LEDA46 (U1_46.2), LEDA47 (U1_47.5)
CI48: LEDA47 (U1_47.2), LEDA48 (U1_48.5)
CI49: LEDA48 (U1_48.2), LEDA49 (U1_49.5)
CI50: LEDA49 (U1_49.2), LEDA50 (U1_50.5)
CI51: LEDA50 (U1_50.2), LEDA51 (U1_51.5)
CI52: LEDA51 (U1_51.2), LEDA52 (U1_52.5)
CI53: LEDA52 (U1_52.2), LEDA53 (U1_53.5)
CI54: LEDA53 (U1_53.2), LEDA54 (U1_54.5)
CI55: LEDA54 (U1_54.2), LEDA55 (U1_55.5)
CI56: LEDA55 (U1_55.2), LEDA56 (U1_56.5)
CI57: LEDA56 (U1_56.2), LEDA57 (U1_57.5)
CI58: LEDA57 (U1_57.2), LEDA58 (U1_58.5)
CI59: LEDA58 (U1_58.2), LEDA59 (U1_59.5)
CI60: LEDA59 (U1_59.2), LEDA60 (U1_60.5)
CI61: LEDA60 (U1_60.2), LEDA61 (U1_61.5)
CI62: LEDA61 (U1_61.2), LEDA62 (U1_62.5)
CI63: LEDA62 (U1_62.2), LEDA63 (U1_63.5)
CI64: LEDA63 (U1_63.2), LEDA64 (U1_64.5)
CI65: LEDA64 (U1_64.2), LEDA65 (U1_65.5)
CI66: LEDA65 (U1_65.2), LEDA66 (U1_66.5)
CI67: LEDA66 (U1_66.2), LEDA67 (U1_67.5)
CI68: LEDA67 (U1_67.2), LEDA68 (U1_68.5)
CI69: LEDA68 (U1_68.2), LEDA69 (U1_69.5)
CI70: LEDA69 (U1_69.2), LEDA70 (U1_70.5)
CI71: LEDA70 (U1_70.2), LEDA71 (U1_71.5)
CI72: LEDA71 (U1_71.2), LEDA72 (U1_72.5)
CI73: LEDA72 (U1_72.2), LEDA73 (U1_73.5)
CI74: LEDA73 (U1_73.2), LEDA74 (U1_74.5)
CI75: LEDA74 (U1_74.2), LEDA75 (U1_75.5)
CI76: LEDA75 (U1_75.2), LEDA76 (U1_76.5)
CI77: LEDA76 (U1_76.2), LEDA77 (U1_77.5)
CI78: LEDA77 (U1_77.2), LEDA78 (U1_78.5)
CI79: LEDA78 (U1_78.2), LEDA79 (U1_79.5)
CI80: LEDA79 (U1_79.2), LEDA80 (U1_80.5)
CI81: LEDA80 (U1_80.2), LEDA81 (U1_81.5)
CI82: LEDA81 (U1_81.2), LEDA82 (U1_82.5)
CI83: LEDA82 (U1_82.2), LEDA83 (U1_83.5)
CI84: LEDA83 (U1_83.2), LEDA84 (U1_84.5)
CI85: LEDA84 (U1_84.2), LEDA85 (U1_85.5)
CI86: LEDA85 (U1_85.2), LEDA86 (U1_86.5)
CI87: LEDA86 (U1_86.2), LEDA87 (U1_87.5)
CI88: LEDA87 (U1_87.2), LEDA88 (U1_88.5)
CI89: LEDA88 (U1_88.2), LEDA89 (U1_89.5)
CI90: LEDA89 (U1_89.2), LEDA90 (U1_90.5)
CI91: LEDA90 (U1_90.2), LEDA91 (U1_91.5)
CI92: LEDA91 (U1_91.2), LEDA92 (U1_92.5)
CI93: LEDA92 (U1_92.2), LEDA93 (U1_93.5)
CI94: LEDA93 (U1_93.2), LEDA94 (U1_94.5)
CI95: LEDA94 (U1_94.2), LEDA95 (U1_95.5)
CI96: LEDA95 (U1_95.2), LEDA96 (U1_96.5)
CI97: LEDA96 (U1_96.2), LEDA97 (U1_97.5)
CI98: LEDA97 (U1_97.2), LEDA98 (U1_98.5)
CI99: LEDA98 (U1_98.2), LEDA99 (U1_99.5)
CI100: LEDA99 (U1_99.2), LEDA100 (U1_100.5)
CI101: LEDA100 (U1_100.2), LEDA101 (U1_101.5)
CI102: LEDA101 (U1_101.2), LEDA102 (U1_102.5)
CI103: LEDA102 (U1_102.2), LEDA103 (U1_103.5)
CI104: LEDA103 (U1_103.2), LEDA104 (U1_104.5)
CI105: LEDA104 (U1_104.2), LEDA105 (U1_105.5)
CI106: LEDA105 (U1_105.2), LEDA106 (U1_106.5)
CI107: LEDA106 (U1_106.2), LEDA107 (U1_107.5)
CI108: LEDA107 (U1_107.2), LEDA108 (U1_108.5)
CI109: LEDA108 (U1_108.2), LEDA109 (U1_109.5)
CI110: LEDA109 (U1_109.2), LEDA110 (U1_110.5)
CI111: LEDA110 (U1_110.2), LEDA111 (U1_111.5)
CI112: LEDA111 (U1_111.2), LEDA112 (U1_112.5)
CI113: LEDA112 (U1_112.2), LEDA113 (U1_113.5)
CI114: LEDA113 (U1_113.2), LEDA114 (U1_114.5)
CI115: LEDA114 (U1_114.2), LEDA115 (U1_115.5)
CI116: LEDA115 (U1_115.2), LEDA116 (U1_116.5)
CI117: LEDA116 (U1_116.2), LEDA117 (U1_117.5)
CI118: LEDA117 (U1_117.2), LEDA118 (U1_118.5)
CI119: LEDA118 (U1_118.2), LEDA119 (U1_119.5)
CI120: LEDA119 (U1_119.2), LEDA120 (U1_120.5)
CI121: LEDA120 (U1_120.2), LEDA121 (U1_121.5)
CI122: LEDA121 (U1_121.2), LEDA122 (U1_122.5)
CI123: LEDA122 (U1_122.2), LEDA123 (U1_123.5)
CI124: LEDA123 (U1_123.2), LEDA124 (U1_124.5)
CI125: LEDA124 (U1_124.2), LEDA125 (U1_125.5)
CI126: LEDA125 (U1_125.2), LEDA126 (U1_126.5)
CI127: LEDA126 (U1_126.2), LEDA127 (U1_127.5)
CI128: LEDA127 (U1_127.2), LEDA128 (U1_128.5)
CI129: LEDA128 (U1_128.2), LEDA129 (U1_129.5)
CI130: LEDA129 (U1_129.2), LEDA130 (U1_130.5)
CI131: LEDA130 (U1_130.2), LEDA131 (U1_131.5)
CI132: LEDA131 (U1_131.2), LEDA132 (U1_132.5)
CI133: LEDA132 (U1_132.2), LEDA133 (U1_133.5)
CI134: LEDA133 (U1_133.2), LEDA134 (U1_134.5)
CI135: LEDA134 (U1_134.2), LEDA135 (U1_135.5)
CI136: LEDA135 (U1_135.2), LEDA136 (U1_136.5)
CI137: LEDA136 (U1_136.2), LEDA137 (U1_137.5)
CI138: LEDA137 (U1_137.2), LEDA138 (U1_138.5)
CI139: LEDA138 (U1_138.2), LEDA139 (U1_139.5)
CI140: LEDA139 (U1_139.2), LEDA140 (U1_140.5)
CI141: LEDA140 (U1_140.2), LEDA141 (U1_141.5)
CI142: LEDA141 (U1_141.2), LEDA142 (U1_142.5)
CI143: LEDA142 (U1_142.2), LEDA143 (U1_143.5)
CI144: LEDA143 (U1_143.2), LEDA144 (U1_144.5)
CI145: LEDA144 (U1_144.2), LEDA145 (U1_145.5)
CI146: LEDA145 (U1_145.2), LEDA146 (U1_146.5)
CI147: LEDA146 (U1_146.2), LEDA147 (U1_147.5)
CI148: LEDA147 (U1_147.2), LEDA148 (U1_148.5)
CI149: LEDA148 (U1_148.2), LEDA149 (U1_149.5)
CI150: LEDA149 (U1_149.2), LEDA150 (U1_150.5)
CI151: LEDA150 (U1_150.2), LEDA151 (U1_151.5)
CI152: LEDA151 (U1_151.2), LEDA152 (U1_152.5)
CI153: LEDA152 (U1_152.2), LEDA153 (U1_153.5)
CI154: LEDA153 (U1_153.2), LEDA154 (U1_154.5)
CI155: LEDA154 (U1_154.2), LEDA155 (U1_155.5)
CI156: LEDA155 (U1_155.2), LEDA156 (U1_156.5)
CI157: LEDA156 (U1_156.2), LEDA157 (U1_157.5)
CI158: LEDA157 (U1_157.2), LEDA158 (U1_158.5)
CI159: LEDA158 (U1_158.2), LEDA159 (U1_159.5)
CI160: LEDA159 (U1_159.2), LEDA160 (U1_160.5)
CI161: LEDA160 (U1_160.2), LEDA161 (U1_161.5)
CI162: LEDA161 (U1_161.2), LEDA162 (U1_162.5)
CI163: LEDA162 (U1_162.2), LEDA163 (U1_163.5)